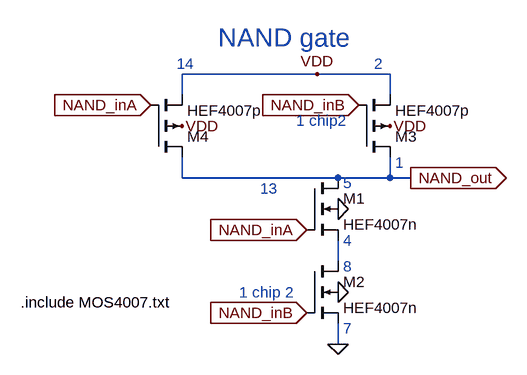
[diagram p0: schematic NAND.asc]
NAND.asc, the LTspice schematic file:
Version 4
SHEET 1 880 680
WIRE 192 -112 -16 -112
WIRE 304 -112 192 -112
WIRE -16 -80 -16 -112
WIRE 304 -80 304 -112
WIRE -16 48 -16 16
WIRE 224 48 -16 48
WIRE 304 48 304 16
WIRE 304 48 224 48
WIRE 336 48 304 48
WIRE 224 176 224 144
WIRE 224 304 224 272
FLAG 304 -32 VDD
FLAG -16 -32 VDD
FLAG -64 -64 NAND_inA
IOPIN -64 -64 In
FLAG 176 128 NAND_inA
IOPIN 176 128 In
FLAG 256 -64 NAND_inB
IOPIN 256 -64 In
FLAG 176 256 NAND_inB
IOPIN 176 256 In
FLAG 336 48 NAND_out
IOPIN 336 48 Out
FLAG 224 224 0
FLAG 224 304 0
FLAG 192 -112 VDD
FLAG 224 96 0
SYMBOL nmos4 176 48 R0
SYMATTR InstName M1
SYMATTR Value HEF4007n
SYMBOL nmos4 176 176 R0
SYMATTR InstName M2
SYMATTR Value HEF4007n
SYMBOL pmos4 256 16 M180
SYMATTR InstName M3
SYMATTR Value HEF4007p
SYMBOL pmos4 -64 16 M180
SYMATTR InstName M4
SYMATTR Value HEF4007p
TEXT -264 240 Left 2 !.include MOS4007.txt
TEXT 40 -168 Left 4 ;NAND gate
TEXT -24 -128 Left 2 ;14
TEXT 280 -128 Left 2 ;2
TEXT 104 64 Left 2 ;13
TEXT 312 24 Left 2 ;1
TEXT 232 56 Left 2 ;5
TEXT 232 144 Left 2 ;4
TEXT 232 184 Left 2 ;8
TEXT 232 280 Left 2 ;7
TEXT 160 -40 Left 2 ;1 chip2
TEXT 72 224 Left 2 ;1 chip 2

The netlist it stands for:
* NAND.asc
M1 NAND_out NAND_inA N001 0 HEF4007n
M2 N001 NAND_inB 0 0 HEF4007n
M3 NAND_out NAND_inB VDD VDD HEF4007p
M4 NAND_out NAND_inA VDD VDD HEF4007p
.model NMOS NMOS
.model PMOS PMOS
.lib standard.mos
.include MOS4007.txt
* NAND gate
* 14
* 2
* 13
* 1
* 5
* 4
* 8
* 7
* 1 chip2
* 1 chip 2
.backanno
.end